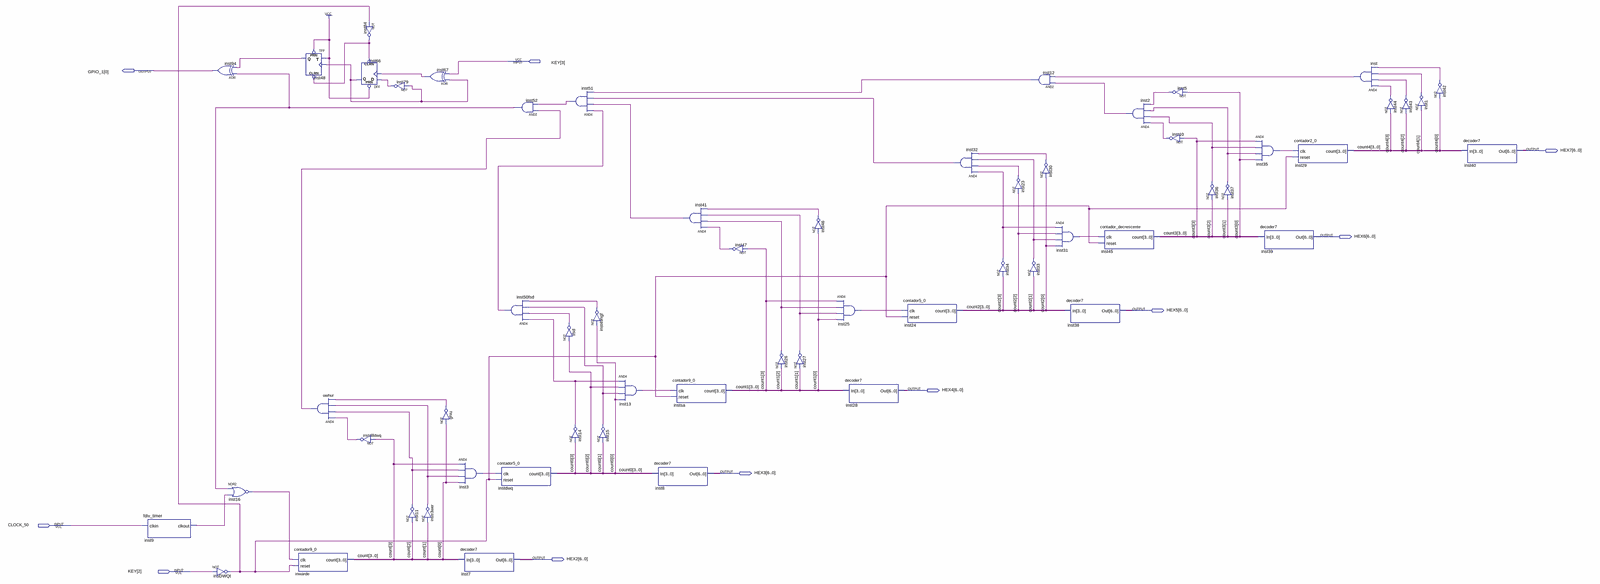
[diagram p0: schematic sheet, whole]
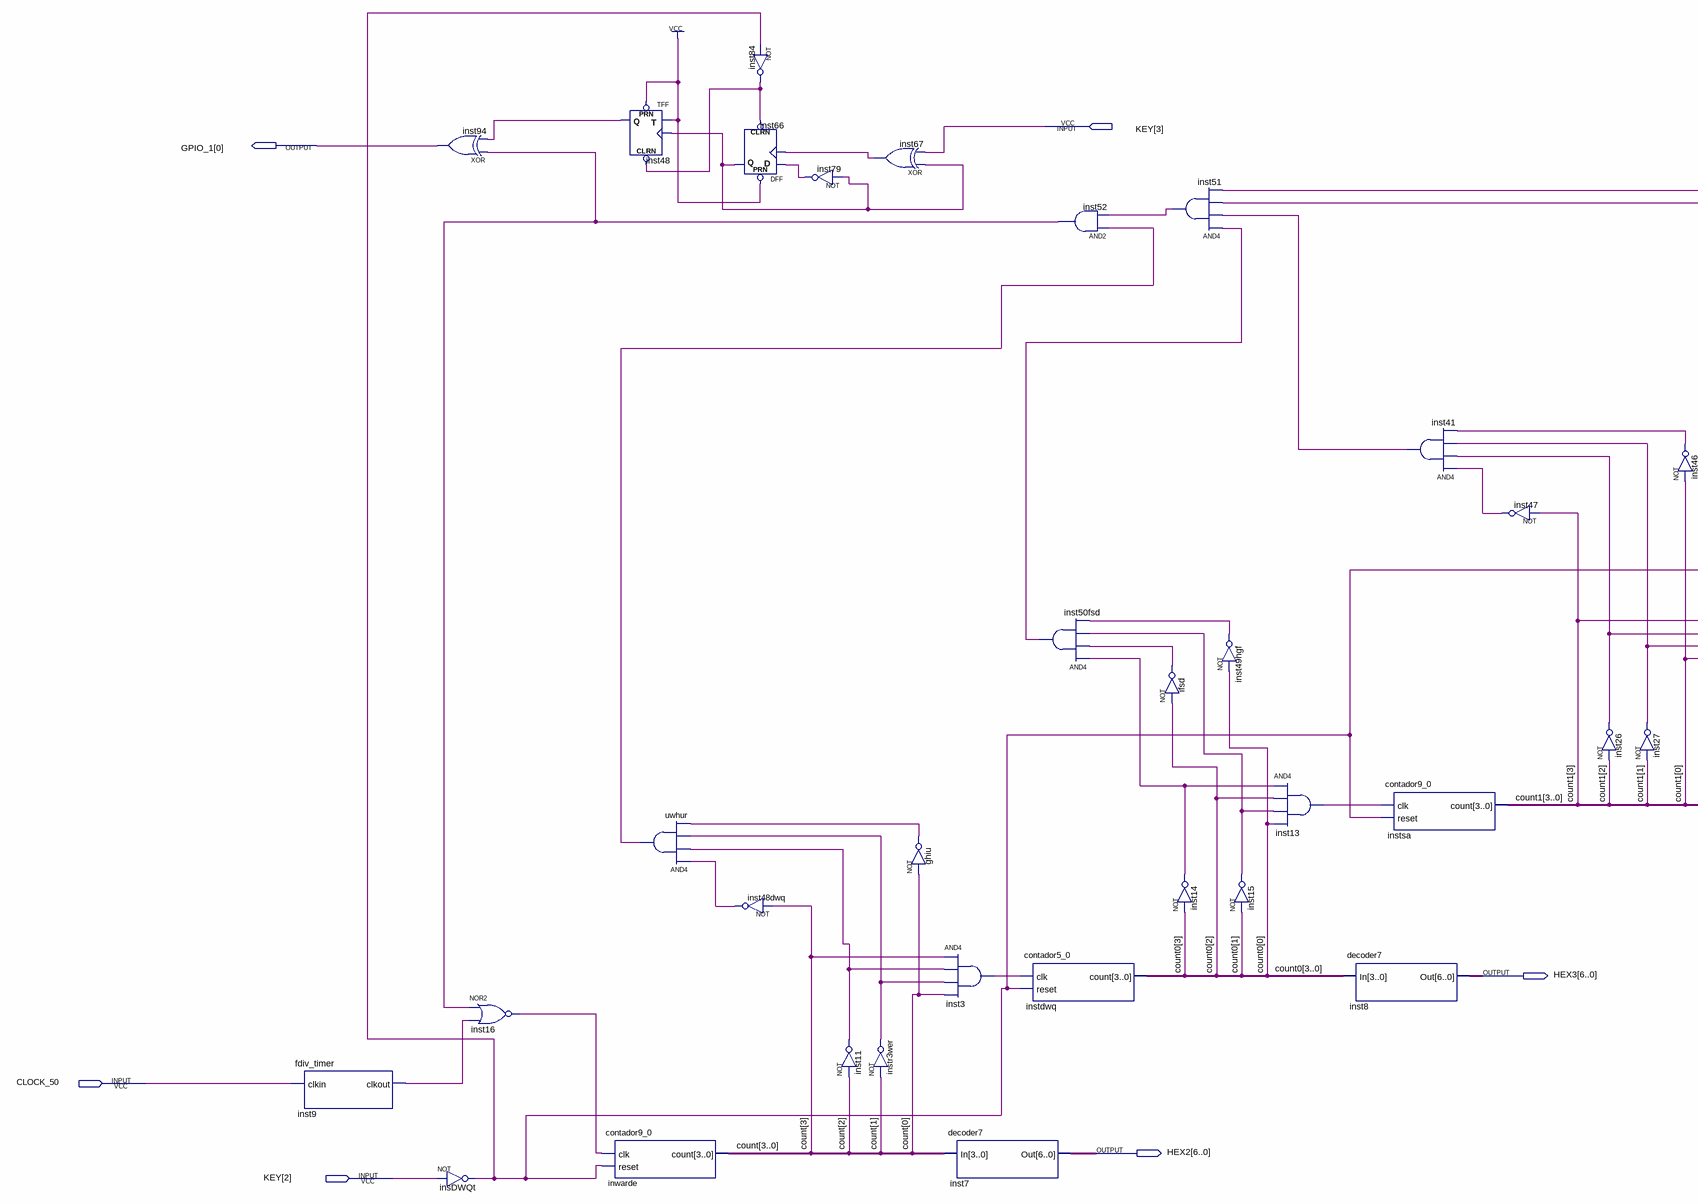
[diagram p1: schematic sheet, left part]
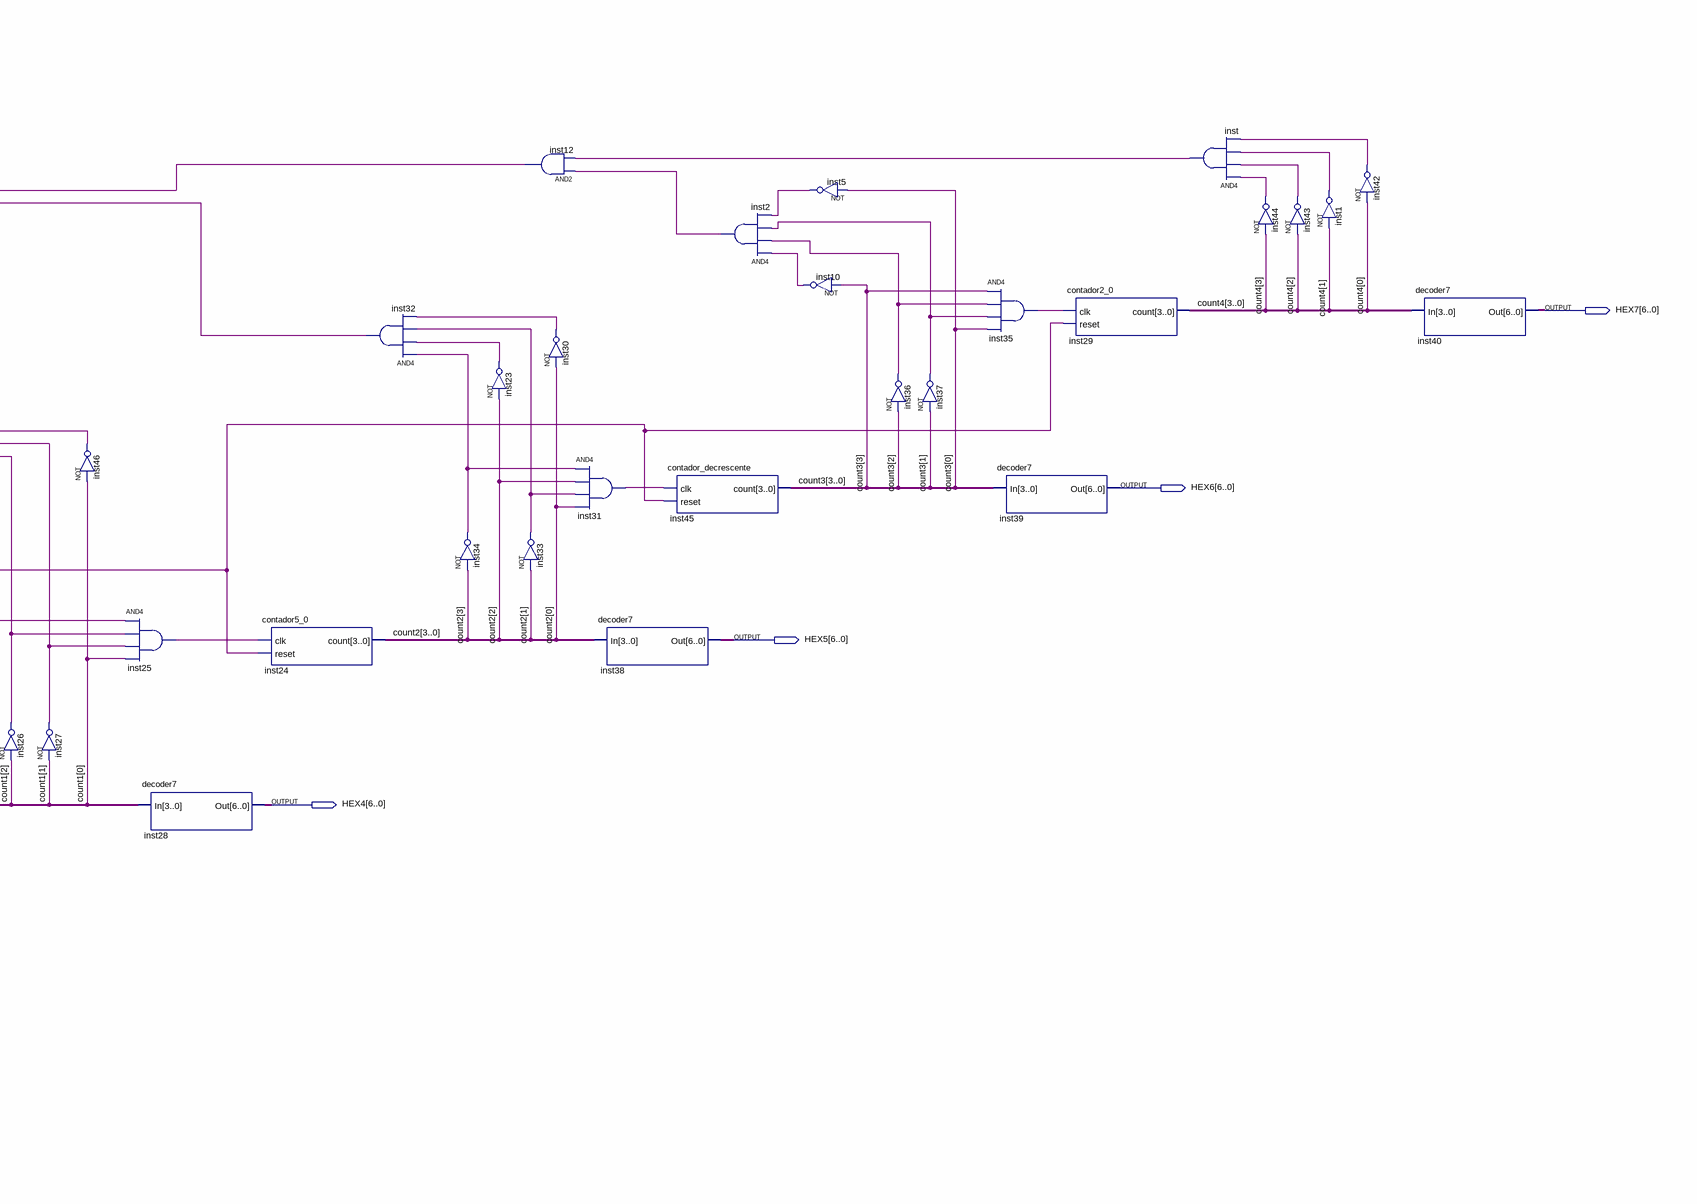
[diagram p2: schematic sheet, right part]
// Quartus schematic timer.bdf as structural Verilog: 59 symbols, 10 pins
module timer (
  input  [3:2] KEY,
  input  CLOCK_50,
  output [0:0] GPIO_1,
  output [6:0] HEX7,
  output [6:0] HEX6,
  output [6:0] HEX5,
  output [6:0] HEX4,
  output [6:0] HEX3,
  output [6:0] HEX2
);

  wire ghiu_out, ifsd_out, insDWQt_out, inst1_out, inst2_out, inst3_out, inst5_out, inst9_clkout, inst10_out,
       inst11_out, inst12_out, inst13_out, inst14_out, inst15_out, inst16_out, inst23_out, inst25_out,
       inst26_out, inst27_out, inst30_out, inst31_out, inst32_out, inst33_out, inst34_out, inst35_out,
       inst36_out, inst37_out, inst41_out, inst42_out, inst43_out, inst44_out, inst46_out, inst47_out,
       inst48_q, inst48dwq_out, inst49hgf_out, inst50fsd_out, inst51_out, inst52_out, inst66_q, inst67_out,
       inst79_out, inst84_out, inst_out, instr3wer_out, uwhur_out;
  wire [3:0] count, count0, count1, count2, count3, count4;

  fdiv_timer inst9 (.clkin(CLOCK_50), .clkout(inst9_clkout));
  xor inst94 (GPIO_1[0], inst52_out, inst48_q);
  nor inst16 (inst16_out, inst52_out, inst9_clkout);
  not insDWQt (insDWQt_out, KEY[2]);
  TFF inst48 (.PRN(1'b1), .CLRN(inst84_out), .T(1'b1), .CLK(inst66_q), .Q(inst48_q));
  contador9_0 inwarde (.clk(inst16_out), .reset(insDWQt_out), .count(count));
  and uwhur (uwhur_out, inst48dwq_out, inst11_out, instr3wer_out, ghiu_out);
  not inst84 (inst84_out, insDWQt_out);
  DFF inst66 (.CLRN(inst84_out), .CLK(inst67_out), .D(inst79_out), .PRN(1'b1), .Q(inst66_q));
  not inst48dwq (inst48dwq_out, count[3]);
  not inst79 (inst79_out, inst66_q);
  xor inst67 (inst67_out, inst66_q, KEY[3]);
  not inst11 (inst11_out, count[2]);
  not instr3wer (instr3wer_out, count[1]);
  not ghiu (ghiu_out, count[0]);
  and inst3 (inst3_out, count[3], inst11_out, instr3wer_out, count[0]);
  decoder7 inst7 (.In(count), .Out(HEX2));
  contador5_0 instdwq (.clk(inst3_out), .reset(insDWQt_out), .count(count0));
  and inst52 (inst52_out, uwhur_out, inst51_out);
  and inst50fsd (inst50fsd_out, inst14_out, ifsd_out, inst15_out, inst49hgf_out);
  and inst51 (inst51_out, inst50fsd_out, inst41_out, inst32_out, inst12_out);
  not ifsd (ifsd_out, count0[2]);
  not inst14 (inst14_out, count0[3]);
  not inst49hgf (inst49hgf_out, count0[0]);
  not inst15 (inst15_out, count0[1]);
  and inst13 (inst13_out, inst14_out, count0[2], inst15_out, count0[0]);
  contador9_0 instsa (.clk(inst13_out), .reset(insDWQt_out), .count(count1));
  decoder7 inst8 (.In(count0), .Out(HEX3));
  and inst41 (inst41_out, inst47_out, inst26_out, inst27_out, inst46_out);
  not inst47 (inst47_out, count1[3]);
  not inst26 (inst26_out, count1[2]);
  not inst27 (inst27_out, count1[1]);
  not inst46 (inst46_out, count1[0]);
  and inst25 (inst25_out, count1[3], inst26_out, inst27_out, count1[0]);
  decoder7 inst28 (.In(count1), .Out(HEX4));
  contador5_0 inst24 (.clk(inst25_out), .reset(insDWQt_out), .count(count2));
  and inst32 (inst32_out, inst34_out, inst23_out, inst33_out, inst30_out);
  not inst23 (inst23_out, count2[2]);
  not inst34 (inst34_out, count2[3]);
  and inst12 (inst12_out, inst2_out, inst_out);
  not inst30 (inst30_out, count2[0]);
  not inst33 (inst33_out, count2[1]);
  and inst31 (inst31_out, inst34_out, count2[2], inst33_out, count2[0]);
  decoder7 inst38 (.In(count2), .Out(HEX5));
  contador_decrescente inst45 (.clk(inst31_out), .reset(insDWQt_out), .count(count3));
  and inst2 (inst2_out, inst10_out, inst36_out, inst37_out, inst5_out);
  not inst10 (inst10_out, count3[3]);
  not inst5 (inst5_out, count3[0]);
  not inst36 (inst36_out, count3[2]);
  not inst37 (inst37_out, count3[1]);
  and inst35 (inst35_out, count3[3], inst36_out, inst37_out, count3[0]);
  decoder7 inst39 (.In(count3), .Out(HEX6));
  contador2_0 inst29 (.clk(inst35_out), .reset(insDWQt_out), .count(count4));
  and inst (inst_out, inst44_out, inst43_out, inst1_out, inst42_out);
  not inst44 (inst44_out, count4[3]);
  not inst43 (inst43_out, count4[2]);
  not inst42 (inst42_out, count4[0]);
  not inst1 (inst1_out, count4[1]);
  decoder7 inst40 (.In(count4), .Out(HEX7));
endmodule
